# Altium schematic sheet Connectors pinout.SchDoc
size A; SheetNumber: 5; SheetTotal: 7
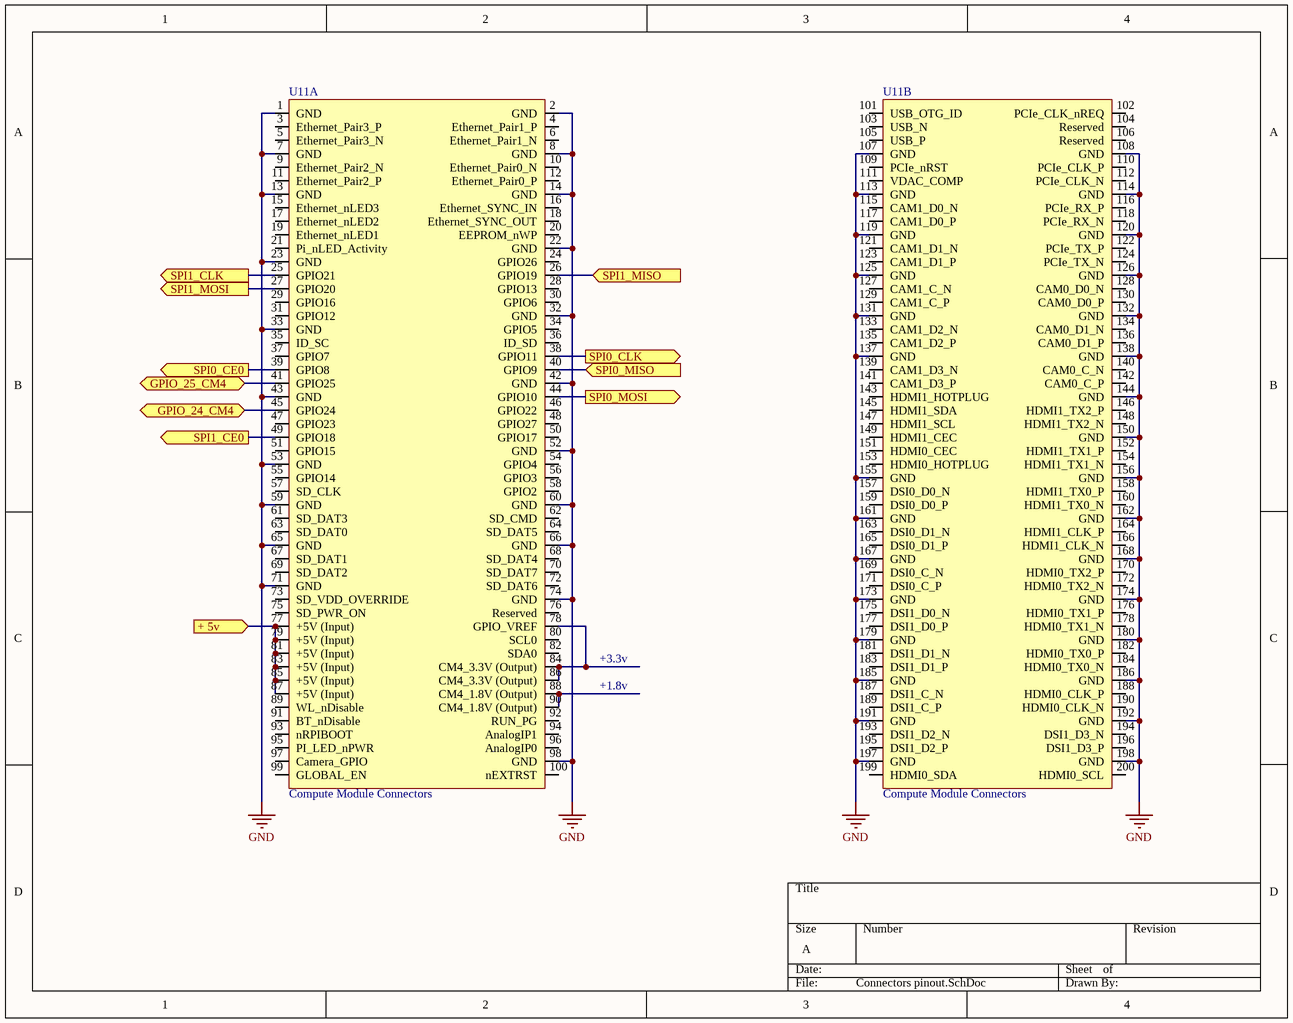
[diagram p0: Connectors pinout.SchDoc]

## Parts
U11  Compute Module Connectors  [CM4-DF40HC(3.0)-100DS-0.4v_3mm_1.5mm_NO_Outline-3D]  (parts A,B of 2)

## Ports
+ 5v (in, see schematic[2B]), GPIO_24_CM4 (bidir, see schematic[2B]), GPIO_25_CM4 (bidir, see schematic[2B]), SPI0_CE0 (out, see schematic[2B], CAN_controller_trancs[2B]), SPI0_CLK (out, see schematic[2B], CAN_controller_trancs[2B]), SPI0_MISO (in, see schematic[2B], CAN_controller_trancs[2B]), SPI0_MOSI (out, see schematic[2B], CAN_controller_trancs[2B]), SPI1_CE0 (out, see schematic[2B], CAN_controller_trancs[2C]), SPI1_CLK (out, see schematic[2B], CAN_controller_trancs[2C]), SPI1_MISO (in, see schematic[2B], CAN_controller_trancs[2C]), SPI1_MOSI (out, see schematic[2B], CAN_controller_trancs[2C])

## Nets
GND: U11.1(GND) U11.2(GND) U11.7(GND) U11.8(GND) U11.13(GND) U11.14(GND) U11.22(GND) U11.23(GND) U11.32(GND) U11.33(GND) U11.42(GND) U11.43(GND) U11.52(GND) U11.53(GND) U11.59(GND) U11.60(GND) U11.65(GND) U11.66(GND) U11.71(GND) U11.74(GND) U11.98(GND) U11.107(GND) U11.108(GND) U11.113(GND) U11.114(GND) U11.119(GND) U11.120(GND) U11.125(GND) U11.126(GND) U11.131(GND) U11.132(GND) U11.137(GND) U11.138(GND) U11.144(GND) U11.150(GND) U11.155(GND) U11.156(GND) U11.161(GND) U11.162(GND) U11.167(GND) U11.168(GND) U11.173(GND) U11.174(GND) U11.179(GND) U11.180(GND) U11.185(GND) U11.186(GND) U11.191(GND) U11.192(GND) U11.197(GND) U11.198(GND)
+ 5v: U11.77(+5V_(Input)) U11.79(+5V_(Input)) U11.81(+5V_(Input)) U11.83(+5V_(Input)) U11.85(+5V_(Input)) U11.87(+5V_(Input)) ; port + 5v
GPIO_24_CM4: U11.45(GPIO24) ; port GPIO_24_CM4
GPIO_25_CM4: U11.41(GPIO25) ; port GPIO_25_CM4
SPI0_CE0: U11.39(GPIO8) ; port SPI0_CE0
SPI0_CLK: U11.38(GPIO11) ; port SPI0_CLK
SPI0_MISO: U11.40(GPIO9) ; port SPI0_MISO
SPI0_MOSI: U11.44(GPIO10) ; port SPI0_MOSI
SPI1_CE0: U11.49(GPIO18) ; port SPI1_CE0
SPI1_CLK: U11.25(GPIO21) ; port SPI1_CLK
SPI1_MISO: U11.26(GPIO19) ; port SPI1_MISO
SPI1_MOSI: U11.27(GPIO20) ; port SPI1_MOSI
NetU11_78: U11.78(GPIO_VREF) U11.84(CM4_3.3V_(Output)) U11.86(CM4_3.3V_(Output))
NetU11_88: U11.88(CM4_1.8V_(Output)) U11.90(CM4_1.8V_(Output))

Not connected (* = marked no-connect by the designer): U11 3(Ethernet_Pair3_P) 4(Ethernet_Pair1_P) 5(Ethernet_Pair3_N) 6(Ethernet_Pair1_N) 9(Ethernet_Pair2_N) 10(Ethernet_Pair0_N) 11(Ethernet_Pair2_P) 12(Ethernet_Pair0_P) 15(Ethernet_nLED3) 16(Ethernet_SYNC_IN) 17(Ethernet_nLED2) 18(Ethernet_SYNC_OUT) 19(Ethernet_nLED1) 20(EEPROM_nWP) 21(Pi_nLED_Activity) 24(GPIO26) 28(GPIO13) 29(GPIO16) 30(GPIO6) 31(GPIO12) 34(GPIO5) 35(ID_SC) 36(ID_SD) 37(GPIO7) 46(GPIO22) 47(GPIO23) 48(GPIO27) 50(GPIO17) 51(GPIO15) 54(GPIO4) 55(GPIO14) 56(GPIO3) 57(SD_CLK) 58(GPIO2) 61(SD_DAT3) 62(SD_CMD) 63(SD_DAT0) 64(SD_DAT5) 67(SD_DAT1) 68(SD_DAT4) 69(SD_DAT2) 70(SD_DAT7) 72(SD_DAT6) 73(SD_VDD_OVERRIDE) 75(SD_PWR_ON) 76(Reserved) 80(SCL0) 82(SDA0) 89(WL_nDisable) 91(BT_nDisable) 92(RUN_PG) 93(nRPIBOOT) 94(AnalogIP1) 95(PI_LED_nPWR) 96(AnalogIP0) 97(Camera_GPIO) 99(GLOBAL_EN) 100(nEXTRST) 101(USB_OTG_ID) 102(PCIe_CLK_nREQ) 103(USB_N) 104(Reserved) 105(USB_P) 106(Reserved) 109(PCIe_nRST) 110(PCIe_CLK_P) 111(VDAC_COMP) 112(PCIe_CLK_N) 115(CAM1_D0_N) 116(PCIe_RX_P) 117(CAM1_D0_P) 118(PCIe_RX_N) 121(CAM1_D1_N) 122(PCIe_TX_P) 123(CAM1_D1_P) 124(PCIe_TX_N) 127(CAM1_C_N) 128(CAM0_D0_N) 129(CAM1_C_P) 130(CAM0_D0_P) 133(CAM1_D2_N) 134(CAM0_D1_N) 135(CAM1_D2_P) 136(CAM0_D1_P) 139(CAM1_D3_N) 140(CAM0_C_N) 141(CAM1_D3_P) 142(CAM0_C_P) 143(HDMI1_HOTPLUG) 145(HDMI1_SDA) 146(HDMI1_TX2_P) 147(HDMI1_SCL) 148(HDMI1_TX2_N) 149(HDMI1_CEC) 151(HDMI0_CEC) 152(HDMI1_TX1_P) 153(HDMI0_HOTPLUG) 154(HDMI1_TX1_N) 157(DSI0_D0_N) 158(HDMI1_TX0_P) 159(DSI0_D0_P) 160(HDMI1_TX0_N) 163(DSI0_D1_N) 164(HDMI1_CLK_P) 165(DSI0_D1_P) 166(HDMI1_CLK_N) 169(DSI0_C_N) 170(HDMI0_TX2_P) 171(DSI0_C_P) 172(HDMI0_TX2_N) 175(DSI1_D0_N) 176(HDMI0_TX1_P) 177(DSI1_D0_P) 178(HDMI0_TX1_N) 181(DSI1_D1_N) 182(HDMI0_TX0_P) 183(DSI1_D1_P) 184(HDMI0_TX0_N) 187(DSI1_C_N) 188(HDMI0_CLK_P) 189(DSI1_C_P) 190(HDMI0_CLK_N) 193(DSI1_D2_N) 194(DSI1_D3_N) 195(DSI1_D2_P) 196(DSI1_D3_P) 199(HDMI0_SDA) 200(HDMI0_SCL)

## Notes on the sheet
- +1.8v
- +3.3v